# Altium project DelSlowEGT.PrjPcb
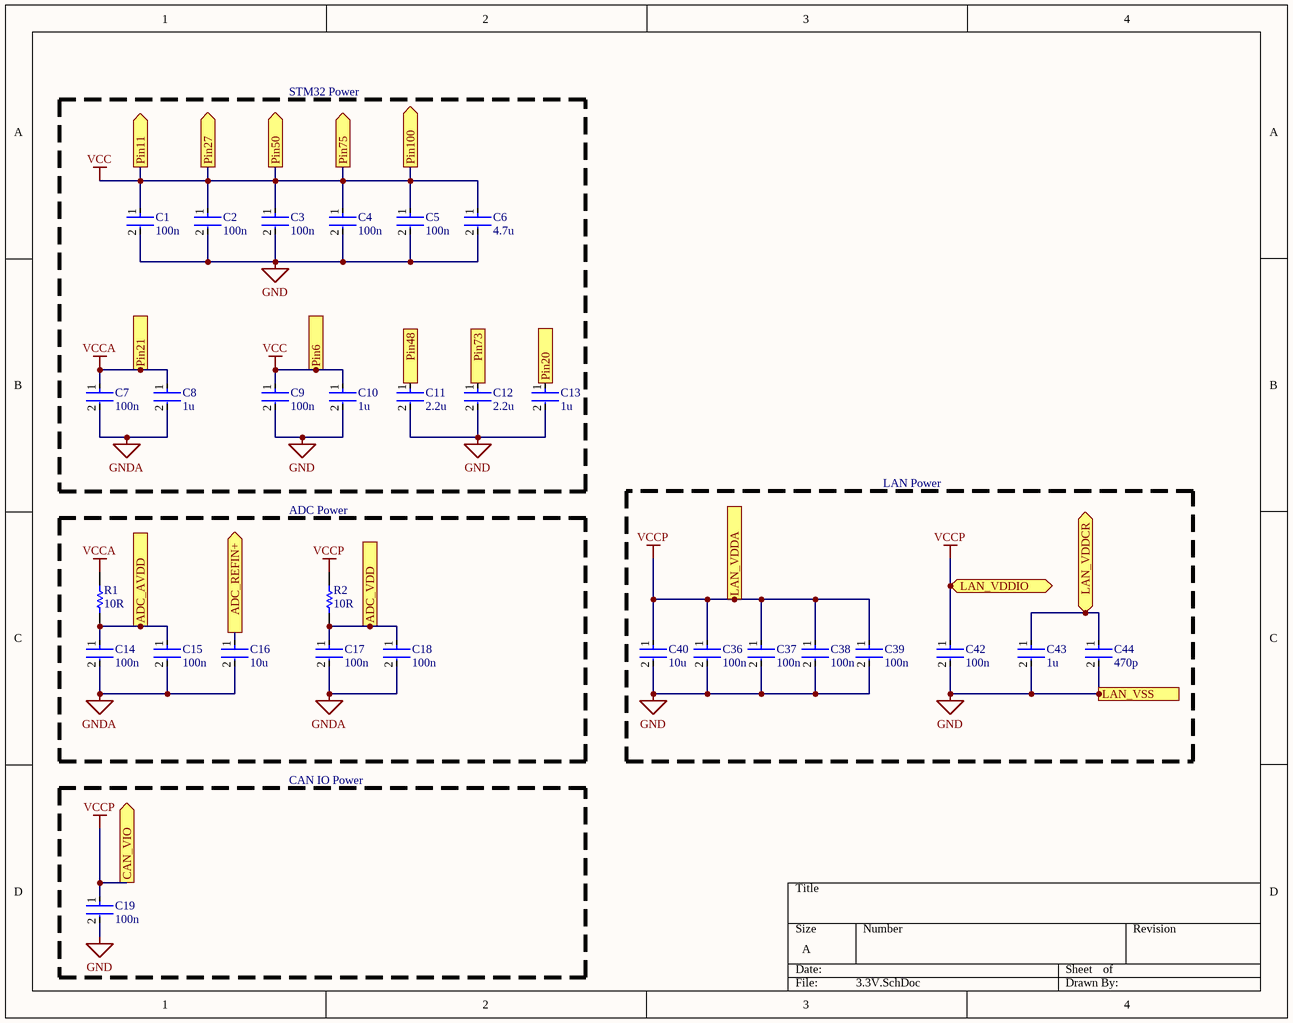
[diagram p0: 3.3V.SchDoc]
7 sheets, 118 parts. Net scope: flat (ports and power ports of the same name join across sheets).
Board file: BoardLayout.PcbDoc
Sheets:
  3.3V.SchDoc
  MCUPinout.SchDoc
  ADC.SchDoc
  BAT.SchDoc
  ETH.SchDoc
  RJ45.SchDoc
  Random.SchDoc

## Sheet 3.3V.SchDoc: 3.3V
size A; DrawnBy: Elijah; SheetNumber: 1; SheetTotal: 7

### Parts
C1  100n  [FP-GRM033-0_03-MFG]
C2  100n  [FP-GRM033-0_03-MFG]
C3  100n  [FP-GRM033-0_03-MFG]
C4  100n  [FP-GRM033-0_03-MFG]
C5  100n  [FP-GRM033-0_03-MFG]
C6  4.7u  [FP-C1005-050-0_15-MFG]
C7  100n  [FP-GRM033-0_03-MFG]
C8  1u  [FP-C2012-125-0_2-IPC_A]
C9  100n  [FP-GRM033-0_03-MFG]
C10  1u  [FP-C2012-125-0_2-IPC_A]
C11  2.2u  [FP-GRM188-0_1-e0_2_0_5-MFG]
C12  2.2u  [FP-GRM188-0_1-e0_2_0_5-MFG]
C13  1u  [FP-C2012-125-0_2-IPC_A]
C14  100n  [FP-GRM033-0_03-MFG]
C15  100n  [FP-GRM033-0_03-MFG]
C16  10u  [FP-C0805C-DG-MFG]
C17  100n  [FP-GRM033-0_03-MFG]
C18  100n  [FP-GRM033-0_03-MFG]
C19  100n  [FP-GRM033-0_03-MFG]
C36  100n  [FP-GRM033-0_03-MFG]
C37  100n  [FP-GRM033-0_03-MFG]
C38  100n  [FP-GRM033-0_03-MFG]
C39  100n  [FP-GRM033-0_03-MFG]
C40  10u  [FP-C0805C-DG-MFG]
C42  100n  [FP-GRM033-0_03-MFG]
C43  1u  [FP-C1005-050-0_15-MFG]
C44  470p  [FP-C1005-050-0_15-MFG]
R1  10R  [RESC2013X60X35ML10T20]
R2  10R  [RESC2013X60X35ML10T20]

### Blocks framed on the sheet
STM32 Power: C1-C13
LAN Power: C36-C40 C42-C44
ADC Power: C14-C18 R1 R2
CAN IO Power: C19

### Ports
ADC_AVDD (out, see ADC[1A]), ADC_REFIN+ (out, see ADC[2B]), ADC_VDD (out, see ADC[2A]), CAN_VIO (out, see ADC[3B]), LAN_VDDA (out, see ETH[2A]), LAN_VDDCR (bidir, see ETH[2B]), LAN_VDDIO (bidir, see ETH[2B]), LAN_VSS (see ETH[3C]), Pin6 (out, see MCUPinout[1A]), Pin11 (out, see MCUPinout[1B]), Pin20 (out, see MCUPinout[3B]), Pin21 (out, see MCUPinout[1B]), Pin27 (out, see MCUPinout[1B]), Pin48 (out, see MCUPinout[3C]), Pin50 (out, see MCUPinout[3A]), Pin73 (out, see MCUPinout[4B]), Pin75 (out, see MCUPinout[3B]), Pin100 (out, see MCUPinout[4A], MCUPinout[5B], MCUPinout[6B])

### Nets
GND: C1.2 C2.2 C3.2 C4.2 C5.2 C6.2 C7.2 C8.2 C9.2 C10.2 C11.2 C12.2 C13.2 C14.2 C15.2 C16.2 C17.2 C18.2 C19.2 C36.2 C37.2 C38.2 C39.2 C40.2 C42.2 C43.2 C44.2 ; port LAN_VSS  [also labelled GNDA]
VCC: C1.1 C2.1 C3.1 C4.1 C5.1 C6.1 C9.1 C10.1 ; port Pin11, port Pin27, port Pin50, port Pin75, port Pin100, port Pin6
VCCA: C7.1 C8.1 R1.1 ; port Pin21
VCCP: C19.1 C36.1 C37.1 C38.1 C39.1 C40.1 C42.1 R2.1 ; port CAN_VIO, port LAN_VDDA, port LAN_VDDIO
NetC11_1: C11.1 ; port Pin48
NetC12_1: C12.1 ; port Pin73
NetC13_1: C13.1 ; port Pin20
NetC14_1: C14.1 C15.1 R1.2 ; port ADC_AVDD
NetC16_1: C16.1 ; port ADC_REFIN+
NetC17_1: C17.1 C18.1 R2.2 ; port ADC_VDD
NetC43_1: C43.1 C44.1 ; port LAN_VDDCR

### Library data of the parts
C1-C5 C7 C9 C14 C15 C17-C19 C36-C39 C42 = CMP-06035-000062-2: Chip Multilayer Ceramic Capacitors for General Purpose, 0201, 0.10uF, X5R, 15%, 10%, 6.3V; Capacitance: 100nF; Min Operating Temperature: -55°C; Lead Free: Lead Free; Radiation Hardening: No; Dielectric: X5R; Voltage Rating (DC): 6.3V; REACH SVHC: No SVHC; Case/Package: 0201; Voltage Rating: 6.3V; Length: 0.6mm; Max Operating Temperature: 85°C; Width: 0.012inch; Depth: 0.3mm; Material: Ceramic; Case Code (Metric): 0603; Thickness: 0.013inch; Packaging: Tape and Reel; Height: 0.3mm; Weight: 6E-06oz; Package Quantity: 1; Mount: Surface Mount; Voltage: 6.3V; Case Code (Imperial): 0201; Tolerance: 10%; Termination: SMD/SMT
C6 C43 C44 = CMP-2000-05997-2: CAP CER 4.7UF 10V X5R 0402; Dielectric Material: Ceramic; Tolerance: 10%; Series: C; Package Quantity: 10000; Max Operating Temperature: 85°C; Case Code (Imperial): 0402; Lead Free: Lead Free; Voltage Rating (DC): 10V; Packaging: Cut Tape; Voltage Rating: 10V; Min Operating Temperature: -55°C; Dielectric: X5R; Thickness: 0.022inch; Width: 0.02inch; Case/Package: 0402; Case Code (Metric): 1005; Capacitance: 4.7uF; Length: 0.039inch; RoHS Compliant: Yes; REACH SVHC: No SVHC; Mount: Surface Mount
C8 C10 C13 = CMP-08246-005389-1: Multilayer Ceramic Capacitors 1μF ±10% 25V X5R SMD 0805; Capacitance: 1uF; Min Operating Temperature: -55°C; Construction: Flat; Package Quantity: 2000; Height: 1.25mm; Resistor Type: Ceramic; Case/Package: 0805; Depth: 1.25mm; Case Code (Metric): 2012; Weight: 0.000194oz; REACH SVHC: No SVHC; Dielectric: X5R; Max Operating Temperature: 85°C; Number of Pins: 2; Thickness: 0.057inch; RoHS Compliant: Yes; Radiation Hardening: No; Lead Free: Lead Free; Case Code (Imperial): 0805; Length: 2mm; Voltage Rating: 25V; Mount: Surface Mount; Voltage Rating (DC): 25V; Packaging: Tape and Reel; Dielectric Material: Ceramic; Termination: SMD/SMT; Voltage: 25V; Tolerance: 10%; Series: C; Width: 0.049inch
C11 C12 = CMP-2006-02836-2: Chip Multilayer Ceramic Capacitors for General Purpose, 0603, 2.2uF, X7R, 15%, 10%, 10V; Case Code (Metric): 1608; Height: 0.8mm; Packaging: Cut Tape; Voltage: 10V; Lead Free: Lead Free; Min Operating Temperature: -55°C; Voltage Rating (DC): 10V; Max Operating Temperature: 125°C; Voltage Rating: 10V; Dielectric: X7R; Depth: 0.8mm; Case Code (Imperial): 0603; Termination: SMD/SMT; Case/Package: 0603; Number of Pins: 2; REACH SVHC: No SVHC; Mount: Surface Mount; Width: 0.031inch; Material: Ceramic; Capacitance: 2.2uF; Package Quantity: 1; Weight: 7.1E-05oz; Length: 1.6mm; Thickness: 0.035inch; Tolerance: 10%
C16 C40 = CMP-2007-03243-2: CAP CER 10UF 10V X5R 0805; Manufacturer Part Number: C0805C106K8PACTU; Manufacturer: Kemet; 3DS Part Number: 220-00001; Tolerance: 10%; Temperature Coefficient: 15%; Material: Ceramic; Device Class L2: Capacitors; Device Class L1: Passive Components; ComponentLink2URL: https://content.kemet.com/datasheets/KEM_C1006_X5R_SMD.pdf; Height: 1.4mm; Lead Free: Yes; Digikey Description: CAP CER 10UF 10V X5R 0805; Octopart: https://octopart.com/c0805c106k8pactu-kemet-98697; Capacitance: 10uF; Value: 10uF; Temperature Range Low: -55°C; Temperature: -55°C to +85°C; Automotive: No; Mouser Description: CAP CER 10UF 10V X5R 0805; Ipc Land Pattern Name: CAPC200125X125; Temperature Range High: +85°C; Voltage: 10V; RoHS: TRUE; Device Class L3: Ceramic Capacitors; ComponentLink2Description: Datasheet; Voltage Rating: 10V; Package: C0805C-DG; Temperature Characteristic: X5R; Category: Cap
R1 R2 = CMP-2100-03670-1: Chip Resistor, 10 Ohm, +/- 1%, 0.125 W, -55 to 155 degC, 0805 (2012 Metric), RoHS, Tape and Reel; Manufacturer: Yageo; Resistance: 10Ohm; Power Rating: 125mW; Voltage Rating: 150V; Temperature Coefficient: 200ppm/degreesC; Number of Pins: 2; REACH SVHC: NoSVHC; Datasheet Version: Rev. 5, 10/2016; Max Operating Temperature: 155degC; Manufacturer URL: http://www.yageo.com/; Case Code (Imperial): 0805; Package Description: 2-Pin Surface Mounted Device, Body 2 x 1.25 mm; Case Code (Metric): 2012; Length: 2mm; RoHSCompliant: true; Max Power Dissipation: 125mW; Depth: 1.25mm; Packaging: TapeandReel; Height: 0.5mm; Package Reference: 0805; Package Quantity: 1; Tolerance: 1%; Termination: SMD/SMT; Min Operating Temperature: -55degC; Lead Free: LeadFree; Width: 1.25mm; Voltage Rating (DC): 150V; Datasheet URL: http://www.yageo.com/NewPortal/yageodocoutput?fileName=/pdf/R-Chip/PYu-RC_Group_51_RoHS_L_5.pdf; Composition: ThickFilm; Number of Terminations: 2; Case/Package: 0805

## Sheet MCUPinout.SchDoc
size B; SheetNumber: 2; SheetTotal: 7
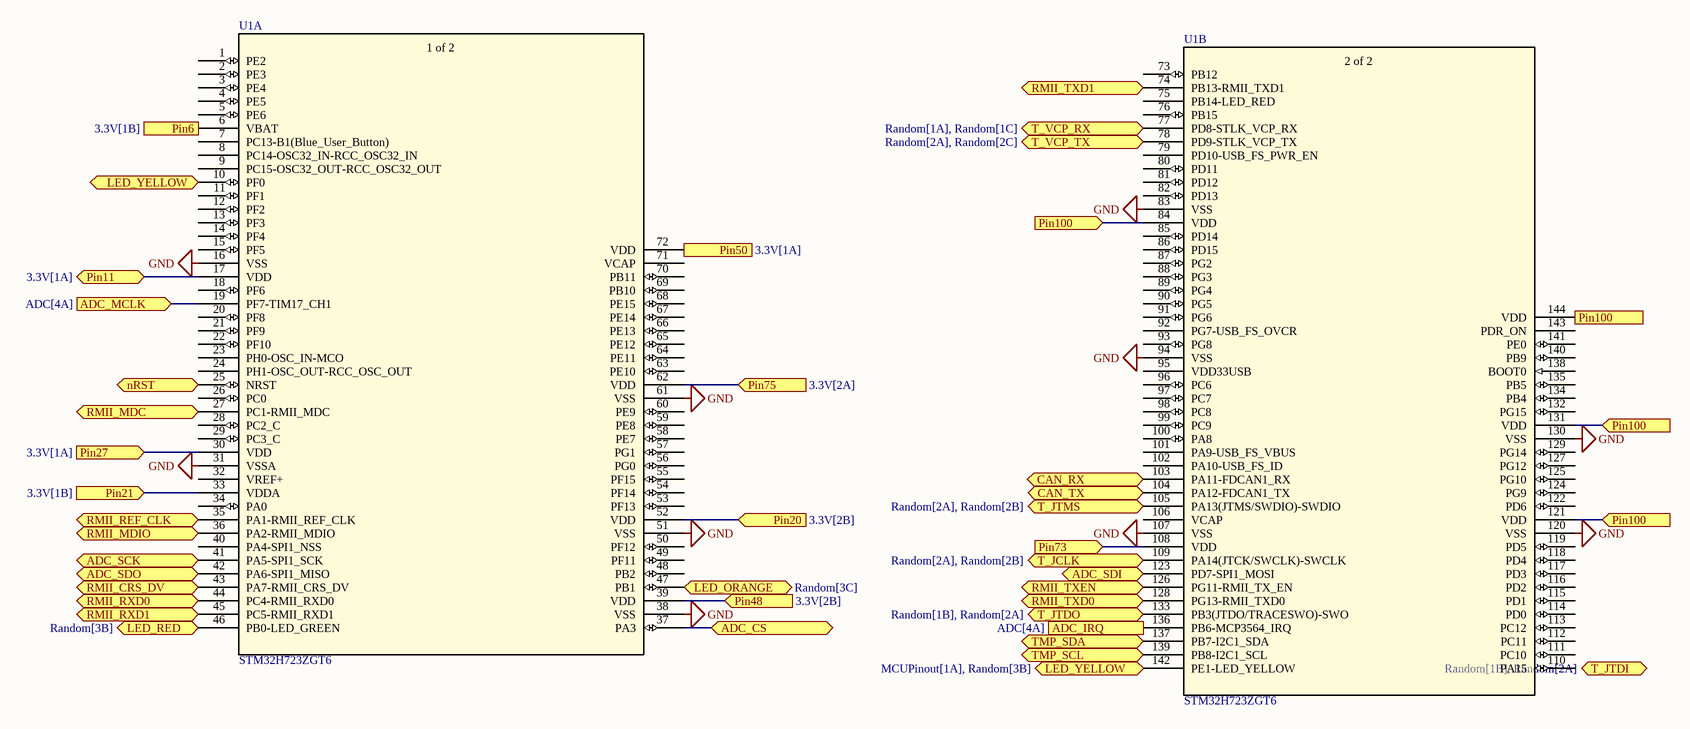
[diagram p1: MCUPinout.SchDoc]

### Parts
U1  STM32H723ZGT6  [LQFP144_STM]  (parts A,B of 2)

### Ports
ADC_CS (bidir, see ADC[4A]), ADC_IRQ (out, see ADC[4A]), ADC_MCLK (in, see ADC[4A]), ADC_SCK (bidir, see ADC[4A]), ADC_SDI (bidir, see ADC[4A]), ADC_SDO (bidir, see ADC[4A]), CAN_RX (bidir, see ADC[3C]), CAN_TX (bidir, see ADC[3C]), LED_ORANGE (bidir, see Random[3C]), LED_RED (bidir, see Random[3B]), LED_YELLOW (bidir, see MCUPinout[1A], Random[3B]), LED_YELLOW (bidir, see MCUPinout[4C], Random[3B]), nRST (bidir, see ETH[1C], Random[2A], Random[2C]), Pin6 (in, see 3.3V[1B]), Pin11 (bidir, see 3.3V[1A]), Pin20 (in, see 3.3V[2B]), Pin21 (in, see 3.3V[1B]), Pin27 (in, see 3.3V[1A]), Pin48 (in, see 3.3V[2B]), Pin50 (in, see 3.3V[1A]), Pin73 (in, see 3.3V[2B]), Pin75 (in, see 3.3V[2A]), Pin100 (in, see 3.3V[2A], MCUPinout[4A], MCUPinout[5B], MCUPinout[6B]), Pin100 (in, see 3.3V[2A], MCUPinout[4A], MCUPinout[6B]), Pin100 (in, see 3.3V[2A], MCUPinout[5B], MCUPinout[6B]), RMII_CRS_DV (bidir, see ETH[1C]), RMII_MDC (bidir, see ETH[1C]), RMII_MDIO (bidir, see ETH[1C]), RMII_REF_CLK (bidir, see ETH[3B]), RMII_RXD0 (bidir, see ETH[1B]), RMII_RXD1 (bidir, see ETH[1B]), RMII_TXD0 (bidir, see ETH[1B]), RMII_TXD1 (bidir, see ETH[1B]), RMII_TXEN (bidir, see ETH[1B]), T_JCLK (bidir, see Random[2A], Random[2B]), T_JTDI (bidir, see Random[1B], Random[2A]), T_JTDO (bidir, see Random[1B], Random[2A]), T_JTMS (bidir, see Random[2A], Random[2B]), T_VCP_RX (bidir, see Random[1A], Random[1C]), T_VCP_TX (bidir, see Random[2A], Random[2C]), TMP_SCL (bidir, see ADC[1D]), TMP_SDA (bidir, see ADC[1D])

### Nets
GND: U1.16(VSS) U1.31(VSSA) U1.38(VSS) U1.51(VSS) U1.61(VSS) U1.83(VSS) U1.94(VSS) U1.107(VSS) U1.120(VSS) U1.130(VSS)
VCC: U1.6(VBAT) U1.17(VDD) U1.30(VDD) U1.62(VDD) U1.72(VDD) U1.84(VDD) U1.121(VDD) U1.131(VDD) U1.144(VDD) ; port Pin11, port Pin27, port Pin50, port Pin75, port Pin100, port Pin6
VCCA: U1.33(VDDA) ; port Pin21
NetC11_1: U1.39(VDD) ; port Pin48
NetC12_1: U1.108(VDD) ; port Pin73
NetC13_1: U1.52(VDD) ; port Pin20
NetD3_1: U1.133(PB3(JTDO/TRACESWO)-SWO) ; port T_JTDO
NetD3_4: U1.109(PA14(JTCK/SWCLK)-SWCLK) ; port T_JCLK
NetD3_6: U1.105(PA13(JTMS/SWDIO)-SWDIO) ; port T_JTMS
NetD4_1: U1.77(PD8-STLK_VCP_RX) ; port T_VCP_RX
NetD4_4: U1.78(PD9-STLK_VCP_TX) ; port T_VCP_TX
NetD4_6: U1.25(NRST) ; port nRST
NetD5_2: U1.46(PB0-LED_GREEN) ; port LED_RED
NetD6_2: U1.10(PF0) U1.142(PE1-LED_YELLOW) ; port LED_YELLOW
NetD7_2: U1.47(PB1) ; port LED_ORANGE
NetR3_2: U1.19(PF7-TIM17_CH1) ; port ADC_MCLK
NetR4_2: U1.136(PB6-MCP3564_IRQ) ; port ADC_IRQ
NetR5_2: U1.41(PA5-SPI1_SCK) ; port ADC_SCK
NetR6_2: U1.123(PD7-SPI1_MOSI) ; port ADC_SDI
NetR7_2: U1.42(PA6-SPI1_MISO) ; port ADC_SDO
NetR8_2: U1.37(PA3) ; port ADC_CS
NetR10_2: U1.139(PB8-I2C1_SCL) ; port TMP_SCL
NetR11_2: U1.137(PB7-I2C1_SDA) ; port TMP_SDA
NetR16_1: U1.36(PA2-RMII_MDIO) ; port RMII_MDIO
NetR18_1: U1.45(PC5-RMII_RXD1) ; port RMII_RXD1
NetR19_1: U1.43(PA7-RMII_CRS_DV) ; port RMII_CRS_DV
NetU1_27: U1.27(PC1-RMII_MDC) ; port RMII_MDC
NetU1_35: U1.35(PA1-RMII_REF_CLK) ; port RMII_REF_CLK
NetU1_44: U1.44(PC4-RMII_RXD0) ; port RMII_RXD0
NetU1_74: U1.74(PB13-RMII_TXD1) ; port RMII_TXD1
NetU1_103: U1.103(PA11-FDCAN1_RX) ; port CAN_RX
NetU1_104: U1.104(PA12-FDCAN1_TX) ; port CAN_TX
NetU1_126: U1.126(PG11-RMII_TX_EN) ; port RMII_TXEN
NetU1_128: U1.128(PG13-RMII_TXD0) ; port RMII_TXD0

Not connected (* = marked no-connect by the designer): U1 1(PE2) 2(PE3) 3(PE4) 4(PE5) 5(PE6) 7(PC13-B1(Blue_User_Button)) 8(PC14-OSC32_IN-RCC_OSC32_IN) 9(PC15-OSC32_OUT-RCC_OSC32_OUT) 11(PF1) 12(PF2) 13(PF3) 14(PF4) 15(PF5) 18(PF6) 20(PF8) 21(PF9) 22(PF10) 23(PH0-OSC_IN-MCO) 24(PH1-OSC_OUT-RCC_OSC_OUT) 26(PC0) 28(PC2_C) 29(PC3_C) 32(VREF+) 34(PA0) 40(PA4-SPI1_NSS) 48(PB2) 49(PF11) 50(PF12) 53(PF13) 54(PF14) 55(PF15) 56(PG0) 57(PG1) 58(PE7) 59(PE8) 60(PE9) 63(PE10) 64(PE11) 65(PE12) 66(PE13) 67(PE14) 68(PE15) 69(PB10) 70(PB11) 71(VCAP) 73(PB12) 75(PB14-LED_RED) 76(PB15) 79(PD10-USB_FS_PWR_EN) 80(PD11) 81(PD12) 82(PD13) 85(PD14) 86(PD15) 87(PG2) 88(PG3) 89(PG4) 90(PG5) 91(PG6) 92(PG7-USB_FS_OVCR) 93(PG8) 95(VDD33USB) 96(PC6) 97(PC7) 98(PC8) 99(PC9) 100(PA8) 101(PA9-USB_FS_VBUS) 102(PA10-USB_FS_ID) 106(VCAP) 110(PA15) 111(PC10) 112(PC11) 113(PC12) 114(PD0) 115(PD1) 116(PD2) 117(PD3) 118(PD4) 119(PD5) 122(PD6) 124(PG9) 125(PG10) 127(PG12) 129(PG14) 132(PG15) 134(PB4) 135(PB5) 138(BOOT0) 140(PB9) 141(PE0) 143(PDR_ON)

### Notes on the sheet
- (in symbol STM32H723ZGT6, part A) 1 of 2
- (in symbol STM32H723ZGT6, part B) 2 of 2

### Library data of the parts
U1 = STM32H723ZGT6: No Description Available; Mfr_Name: STMicroelectronics; RefDes: RefDes; Type: Type

## Sheet ADC.SchDoc
size A; SheetNumber: 3; SheetTotal: 7
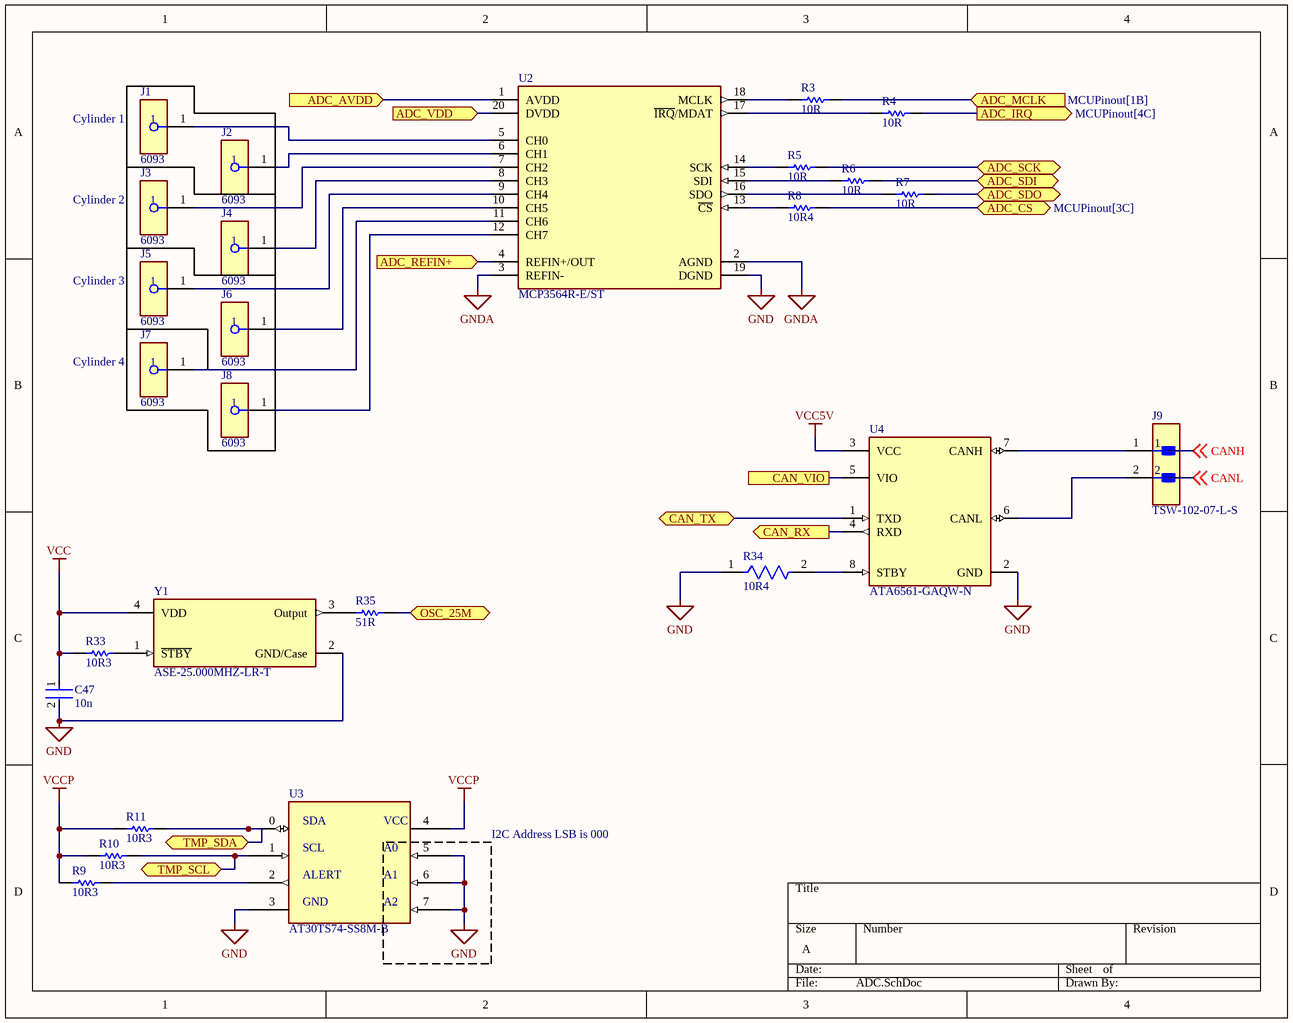
[diagram p2: ADC.SchDoc]

### Parts
C47  10n  [FP-GRM033-0_03-MFG]
J1  6093  [FP-6093-MFG]
J2  6093  [FP-6093-MFG]
J3  6093  [FP-6093-MFG]
J4  6093  [FP-6093-MFG]
J5  6093  [FP-6093-MFG]
J6  6093  [FP-6093-MFG]
J7  6093  [FP-6093-MFG]
J8  6093  [FP-6093-MFG]
J9  TSW-102-07-L-S  [FP-TSW-102-07-L-S-MFG]
R3  10R  [RESC2013X60X35ML10T20]
R4  10R  [RESC2013X60X35ML10T20]
R5  10R  [RESC2013X60X35ML10T20]
R6  10R  [RESC2013X60X35ML10T20]
R7  10R  [RESC2013X60X35ML10T20]
R8  10R4  [RESC2013X60X35ML10T20]
R9  10R3  [RESC3116X65X40ML10T20]
R10  10R3  [RESC3116X65X40ML10T20]
R11  10R3  [RESC3116X65X40ML10T20]
R33  10R3  [RESC3116X65X40ML10T20]
R34  10R4  [FP-RC0603-0_55-IPC_C]
R35  51R  [RESC3116X65X40ML10T20]
U2  MCP3564R-E/ST  [FP-C04-088-MFG]
U3  AT30TS74-SS8M-B  [MCHP-SN8_V]
U4  ATA6561-GAQW-N  [FP-C04-057-OA-MFG]
Y1  ASE-25.000MHZ-LR-T  [FP-ASE-MFG]

### Ports
ADC_AVDD (in, see 3.3V[1C]), ADC_CS (bidir, see MCUPinout[3C]), ADC_IRQ (out, see MCUPinout[4C]), ADC_MCLK (in, see MCUPinout[1B]), ADC_REFIN+ (in, see 3.3V[1C]), ADC_SCK (bidir, see MCUPinout[1B]), ADC_SDI (bidir, see MCUPinout[4B]), ADC_SDO (bidir, see MCUPinout[1B]), ADC_VDD (in, see 3.3V[2C]), CAN_RX (out, see MCUPinout[4B]), CAN_TX (bidir, see MCUPinout[4B]), CAN_VIO (see 3.3V[1D]), OSC_25M (bidir, see ETH[3B]), TMP_SCL (bidir, see MCUPinout[4C]), TMP_SDA (bidir, see MCUPinout[4C])

### Nets
GND: C47.2 R34.1 U2.2(AGND) U2.3(REFIN-) U2.19(DGND) U3.3 U3.5 U3.6 U3.7 U4.2(GND) Y1.2(GND/Case)  [also labelled GNDA]
VCC: C47.1 R33.1 Y1.4(VDD)
VCC5V: U4.3(VCC)
VCCP: R9.1 R10.1 R11.1 U3.4 U4.5(VIO) ; port CAN_VIO
NetC14_1: U2.1(AVDD) ; port ADC_AVDD
NetC16_1: U2.4(REFIN+/OUT) ; port ADC_REFIN+
NetC17_1: U2.20(DVDD) ; port ADC_VDD
NetJ1_1: J1.1 U2.5(CH0)
NetJ2_1: J2.1 U2.6(CH1)
NetJ3_1: J3.1 U2.7(CH2)
NetJ4_1: J4.1 U2.8(CH3)
NetJ5_1: J5.1 U2.9(CH4)
NetJ6_1: J6.1 U2.10(CH5)
NetJ7_1: J7.1 U2.11(CH6)
NetJ8_1: J8.1 U2.12(CH7)
NetJ9_1: J9.1 U4.7(CANH)
NetJ9_2: J9.2 U4.6(CANL)
NetR3_1: R3.1 U2.18(MCLK)
NetR3_2: R3.2 ; port ADC_MCLK
NetR4_1: R4.1 U2.17(~{IRQ}/MDAT)
NetR4_2: R4.2 ; port ADC_IRQ
NetR5_1: R5.1 U2.14(SCK)
NetR5_2: R5.2 ; port ADC_SCK
NetR6_1: R6.1 U2.15(SDI)
NetR6_2: R6.2 ; port ADC_SDI
NetR7_1: R7.1 U2.16(SDO)
NetR7_2: R7.2 ; port ADC_SDO
NetR8_1: R8.1 U2.13(~{CS})
NetR8_2: R8.2 ; port ADC_CS
NetR9_2: R9.2 U3.2
NetR10_2: R10.2 U3.1 ; port TMP_SCL
NetR11_2: R11.2 U3.0 ; port TMP_SDA
NetR23_2: R35.2 ; port OSC_25M
NetR33_2: R33.2 Y1.1(~{STBY})
NetR34_2: R34.2 U4.8(STBY)
NetR35_1: R35.1 Y1.3(Output)
NetU1_103: U4.4(RXD) ; port CAN_RX
NetU1_104: U4.1(TXD) ; port CAN_TX

### Notes on the sheet
- (near J1) Cylinder 1
- (near J3) Cylinder 2
- (near J5) Cylinder 3
- (near J7) Cylinder 4
- I2C Address LSB is 000
- (in symbol AT30TS74_0217) SDA; VCC; SCL; A0; ALERT; A1; GND; A2

### Library data of the parts
C47 = CMP-06035-000062-2: as C1 on sheet 3.3V; Min Operating Temperature: -55°C; Lead Free: Lead Free; Radiation Hardening: No; Dielectric: X5R; Voltage Rating (DC): 6.3V; REACH SVHC: No SVHC; Case/Package: 0201; Voltage Rating: 6.3V; Length: 0.6mm; Max Operating Temperature: 85°C; Width: 0.012inch; Depth: 0.3mm; Material: Ceramic; Case Code (Metric): 0603; Thickness: 0.013inch; Packaging: Tape and Reel; Height: 0.3mm; Weight: 6E-06oz; Package Quantity: 1; Mount: Surface Mount; Voltage: 6.3V; Case Code (Imperial): 0201; Tolerance: 10%; Termination: SMD/SMT
J1-J8 = CMP-19636-000026-1: CONN BANANA JACK SOLDER LUG RED; Gender: Female; Pitch: 0.375inch; Number of Contacts: 3; Insulation: Mating End Insulated; Body Material: Brass; Hole Diameter: 0.12inch; Material: Paper; Contact Material: Brass; Number of Rows: 1; Contact Plating: Tin; Series: -; RoHS Compliant: No; Insulation Material: Nylon; Orientation: Straight; Package Quantity: 1; REACH SVHC: No SVHC; Termination: Solder; Number of Positions: 3; Color: Red; Mount: Panel; Lead Free: Lead Free; Packaging: Bulk
J9 = CMP-02766-001428-1: CONN HEADER VERT 2POS 2.54MM; Voltage Rating: 550V; Current Rating: 7.6A; Gender: Male; Number of Contacts: 2; Connector Type: Male Pin; Radiation Hardening: No; Orientation: Straight; Contact Plating: Gold; Max Operating Temperature: 125°C; Mount: Through Hole; Package Quantity: 1; Number of Rows: 1; Housing Material: Polyester; RoHS Compliant: Yes; Length: 5.08mm; Max Voltage Rating (AC): 550V; Pitch: 2.54mm; Packaging: Bulk; Depth: 2.54mm; Termination: Solder; Min Operating Temperature: -55°C; Housing Color: Black; Lead Free: Lead Free; Color: Black; Number of Positions: 2; Width: 2.54mm; Max Current Rating: 7.6A; REACH SVHC: No SVHC; Contact Material: Bronze; Contact Mating Length: 0.23inch; Series: TSW; Contact Type: Male Pin
R3-R8 = CMP-2100-03670-1: as R1 on sheet 3.3V; Number of Pins: 2; REACH SVHC: NoSVHC; Datasheet Version: Rev. 5, 10/2016; Max Operating Temperature: 155degC; Manufacturer URL: http://www.yageo.com/; Case Code (Imperial): 0805; Package Description: 2-Pin Surface Mounted Device, Body 2 x 1.25 mm; Case Code (Metric): 2012; Length: 2mm; RoHSCompliant: true; Max Power Dissipation: 125mW; Depth: 1.25mm; Packaging: TapeandReel; Height: 0.5mm; Package Reference: 0805; Package Quantity: 1; Tolerance: 1%; Termination: SMD/SMT; Min Operating Temperature: -55degC; Lead Free: LeadFree; Width: 1.25mm; Voltage Rating (DC): 150V; Datasheet URL: http://www.yageo.com/NewPortal/yageodocoutput?fileName=/pdf/R-Chip/PYu-RC_Group_51_RoHS_L_5.pdf; Composition: ThickFilm; Number of Terminations: 2; Case/Package: 0805
R9-R11 R33 R35 = CMP-2100-03678-1: Chip Resistor, 1 KOhm, +/- 1%, 0.25 W, -55 to 155 degC, 1206 (3216 Metric), RoHS, Tape and Reel; Manufacturer: Yageo; Temperature Coefficient: 100ppm/degreesC; Power Rating: 250mW; Voltage Rating: 200V; Resistance: 1KOhm; Composition: ThickFilm; Min Operating Temperature: -55degC; Tolerance: 1%; REACH SVHC: Unknown; Case Code (Metric): 3216; Military Standard: Not; Datasheet Version: Rev. 5, 10/2016; Package Reference: 1206.0; Case/Package: 1206; Length: 3.1mm; Manufacturer URL: http://www.yageo.com/; Lead Free: LeadFree; RoHSCompliant: true; Termination: SMD/SMT; Packaging: TapeandReel; Package Description: 2-Pin Surface Mount Device, Body 3.1 x 1.6 mm; Depth: 1.6mm; Case Code (Imperial): 1206; Max Operating Temperature: 155degC; Datasheet URL: http://www.yageo.com/NewPortal/yageodocoutput?fileName=/pdf/R-Chip/PYu-RC_Group_51_RoHS_L_5.pdf; Height: 0.55mm
R34 = CMP-2100-03664-2: RES 10K OHM 1% 1/10W 0603; Voltage Rating: 75V; Voltage Rating (DC): 50V; Resistance: 10kR; Power Rating: 100mW; Temperature Coefficient: 100ppm/°C; Depth: 0.8mm; Termination: SMD/SMT; Resistor Type: Thick Film; Series: RC; Construction: Rectangular; Features: Moisture Resistant; Packaging: Tape and Reel; Min Operating Temperature: -55°C; Number of Terminations: 2; Lead Pitch: 0.3mm; RoHS Compliant: Yes; Case/Package: 0603; Resistance Tolerance: 1%; Military Standard: Not; Weight: 7.1E-05oz; Number of Pins: 2; Tolerance: 1%; Length: 1.6mm; Case Code (Imperial): 0603; Lead Free: Lead Free; Width: 0.8mm; Max Power Dissipation: 100mW; Height: 0.45mm; Max Operating Temperature: 155°C; Case Code (Metric): 1608; Size Code: 0603
U2 = CMP-00252-111742343-1: MCP3564R-E/ST 8-Channel Single ADC Delta-Sigma 153.6ksps 24-bit Serial 20-Pin TSSOP Tube; Interface: SPI; Max Junction Temperature (Tj): 150°C; Min Supply Voltage: 1.8V; Number of Channels: 8; Max Supply Voltage: 3.6V; Number of Converters: 1; Max Operating Temperature: 125°C; Lifecycle Status: Production; Height: 1.2mm; Ambient Temperature Range High: 125°C; NexarPartId: 111742343; Sampling Rate: 153.6ksps; Min Operating Temperature: -40°C
U3 = AT30TS74_0217: Temp Sensor Digital Serial (2-Wire, I2C, SMBus) 8-Pin SOIC Tube; pin to pad: 0>1 1>2 2>3 3>4 4>5 5>6 6>7 7>8; Manufacturer: Microchip; Package Shape/Style: Rectangular; Accuracy-Max (Cel): 3°C; Number of Bits: 12; Operating Current-Max: 800uA; Sensor Type: TEMPERATURE SENSOR,SWITCH/DIGITAL OUTPUT,SERIAL; Max Supply Voltage: 5.5V; Min Supply Voltage: 1.7V; Body Breadth: 3.9inch; Body Height: 1.75mm; Body Length or Diameter: 4.9mm; Supplier: Mouser; Supplier Part Number: 556-AT30TS74-SS8M-B; Manufacturer Part Number: AT30TS74-SS8M-B; Category: Uncategorized; Stock: 7962; Pricing: 1=0.82, 10=0.82, 50=0.68, 100=0.662, 1000=0.662, 10000=0.654 (USD); Mounting Technology: Surface Mount; Housing Material: Plastic; Min Operating Temperature: -40°C; Max Operating Temperature: 125°C; Output Interface Type: 2-Wire; Termination: Solder; Reach SVHC Compliant: Yes; ComponentLink1URL: https://datasheet.ciiva.com:443/pdfs/VipMasterIC/IC/ATML/ATML-S-A0001248569/ATML-S-A0001248569-1.pdf?src-supplier=IHS+Markit; ComponentLink1Description: https://datasheet.ciiva.com:443/pdfs/VipMasterIC/IC/ATML/ATML-S-A0001248569/ATML-S-A0001248569-1.pdf?src-supplier=IHS+Markit; ComponentLink2URL: http://www.microchip.com/mymicrochip/filehandler.aspx?ddocname=en590216&src-supplier=Digikey; ComponentLink2Description: http://www.microchip.com/mymicrochip/filehandler.aspx?ddocname=en590216&src-supplier=Digikey; ComponentLink3URL: http://www.atmel.com/Images/Atmel-8897-DTS-AT30TS74-Datasheet.pdf?src-supplier=Avnet; ComponentLink3Description: http://www.atmel.com/Images/Atmel-8897-DTS-AT30TS74-Datasheet.pdf?src-supplier=Avnet; ComponentLink4URL: https://datasheet.octopart.com/AT30TS74-SS8M-B-Microchip-datasheet-140384934.pdf?src-supplier=microchipDIRECT; ComponentLink4Description: https://datasheet.octopart.com/AT30TS74-SS8M-B-Microchip-datasheet-140384934.pdf?src-supplier=microchipDIRECT
U4 = CMP-06279-000002-1: IC TRANSCEIVER 1/1 8SO; Manufacturer: Microchip Technology; Min Supply Voltage: 2.8V; Standoff Height: 0.1mm; Nominal Supply Current: 50mA; Interface: CAN; Max Junction Temp: +150°C; Max Supply Voltage: 5.5V; Digikey Description: IC TRANSCEIVER 1/1 8SO; Footprint Url: http://ww1.microchip.com/downloads/en/DeviceDoc/08L_SOIC_150_3dot9mm_OA_C04-00057e.pdf; ComponentLink2Description: Datasheet; Category: IC; Lead Free: Yes; Package: C04-057-OA; Manufacturer Part Number: ATA6561-GAQW-N; Height: 1.75mm; ComponentLink2URL: http://ww1.microchip.com/downloads/en/DeviceDoc/ATA6560-ATA6561-High-Speed-CAN-Transceiver-DS20005991A.pdf; Mouser Description: CAN - Controller Area Network 5Mbps Unpowered/Standby/Normal 4.5V to 5.5V 8-Pin SOIC T/R; Device Class L1: Integrated Circuits (ICs); Device Class L3: unset; Automotive: No; Temperature Range High: +150°C; Temperature: -40°C to +150°C; RoHS: TRUE; Device Class L2: Interface ICs; Temperature Range Low: -40°C; Octopart: https://octopart.com/ata6561-gaqw-n-microchip-93294113; Ipc Land Pattern Name: SOIC127P600X155-8
Y1 = CMP-27762-000357-1: XTAL Oscillator 25MHz ±25ppm CMOS 3.3V 4-SMD 3.2mm x 2.5mm; Min Supply Voltage: 3.135V; Max Supply Current: 13mA; Max Supply Voltage: 3.465V; Load Capacitance: 15pF; Height: 0.047inch; Series: ASE; Frequency Stability: 25ppm; Mount: Surface Mount; Case/Package: SMD/SMT; Width: 0.098inch; Operating Frequency: 25 MHz; REACH SVHC: No SVHC; Package Quantity: 1000; Number of Pins: 4; Termination: SMD/SMT; Frequency: 25MHz; Max Operating Temperature: 85°C; Packaging: Tape and Reel; Min Operating Temperature: -40°C; Lead Free: Lead Free; Length: 0.126inch; Operating Supply Voltage: 3.3V

## Sheet BAT.SchDoc
size A; SheetNumber: 4; SheetTotal: 6
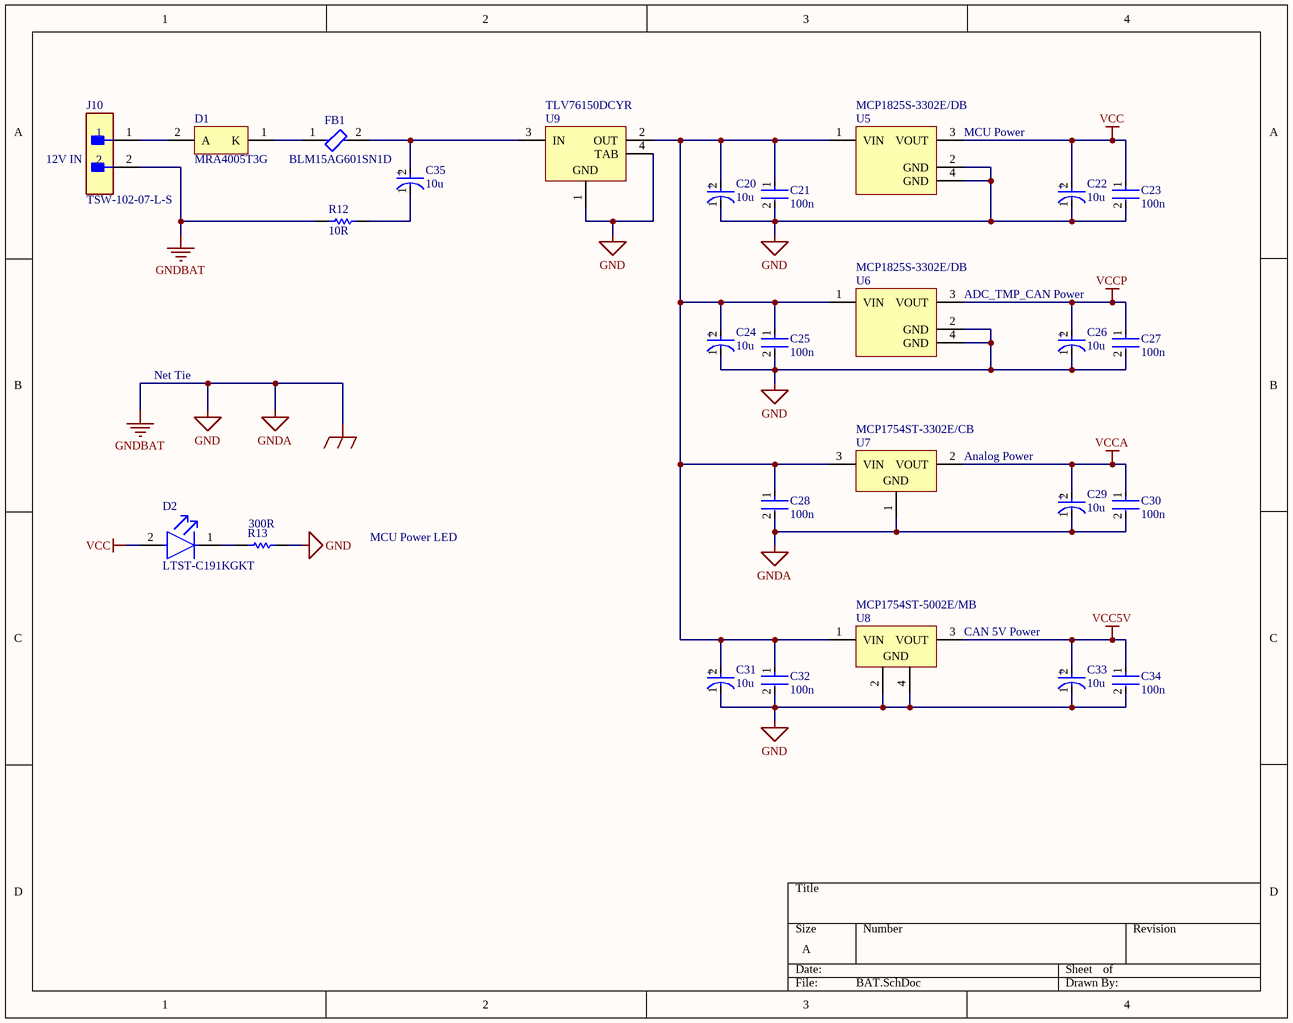
[diagram p3: BAT.SchDoc]

### Parts
C20  10u  [FP-TAJA-MFG]
C21  100n  [FP-GRM033-0_03-MFG]
C22  10u  [FP-TAJA-MFG]
C23  100n  [FP-GRM033-0_03-MFG]
C24  10u  [FP-TAJA-MFG]
C25  100n  [FP-GRM033-0_03-MFG]
C26  10u  [FP-TAJA-MFG]
C27  100n  [FP-GRM033-0_03-MFG]
C28  100n  [FP-GRM033-0_03-MFG]
C29  10u  [FP-TAJA-MFG]
C30  100n  [FP-GRM033-0_03-MFG]
C31  10u  [FP-TAJA-MFG]
C32  100n  [FP-GRM033-0_03-MFG]
C33  10u  [FP-TAJA-MFG]
C34  100n  [FP-GRM033-0_03-MFG]
C35  10u  [FP-TAJA-MFG]
D1  MRA4005T3G  [ONSC-SMA-2-403D-02_V]
D2  LTST-C191KGKT  [FP-LTST-C191KSKT-MFG]
FB1  BLM15AG601SN1D  [FP-BLM15-0_05-MFG]
J10  TSW-102-07-L-S  [FP-TSW-102-07-L-S-MFG]
R12  10R  [RESC2013X60X35ML10T20]
R13  300R  [RESC1608X55X30LL20T20]
U5  MCP1825S-3302E/DB  [SOT-223-DB3_N]
U6  MCP1825S-3302E/DB  [SOT-223-DB3_N]
U7  MCP1754ST-3302E/CB  [MCHP-SOT-23A-CB3_N]
U8  MCP1754ST-5002E/MB  [MCHP-SOT-89-MB3_L]
U9  TLV76150DCYR  [DCY0004A_L]

### Nets
GND: C20.1(C) C21.2 C22.1(C) C23.2 C24.1(C) C25.2 C26.1(C) C27.2 C28.2 C29.1(C) C30.2 C31.1(C) C32.2 C33.1(C) C34.2 J10.2 R12.1 R13.2 U5.2(GND) U5.4(GND) U6.2(GND) U6.4(GND) U7.1(GND) U8.2(GND) U8.4(GND) U9.1(GND) U9.4(TAB)  [also labelled GNDA, GNDBAT]
VCC: C22.2(A) C23.1 D2.2(A) U5.3(VOUT)
VCC5V: C33.2(A) C34.1 U8.3(VOUT)
VCCA: C29.2(A) C30.1 U7.2(VOUT)
VCCP: C26.2(A) C27.1 U6.3(VOUT)
NetC20_2: C20.2(A) C21.1 C24.2(A) C25.1 C28.1 C31.2(A) C32.1 U5.1(VIN) U6.1(VIN) U7.3(VIN) U8.1(VIN) U9.2(OUT)
NetC35_1: C35.1(C) R12.2
NetC35_2: C35.2(A) FB1.2 U9.3(IN)
NetD1_1: D1.1(K) FB1.1
NetD1_2: D1.2(A) J10.1
NetD2_1: D2.1(C) R13.1

### Notes on the sheet
- (near J10) 12V IN
- (near U5) MCU Power
- ADC_TMP_CAN Power
- Net Tie
- (near U7) Analog Power
- MCU Power LED
- (near U8) CAN 5V Power
- (in symbol CMP-04424-000097-1) +

### Library data of the parts
C20 C22 C24 C26 C29 C31 C33 C35 = CMP-04424-000097-1: 10uF 6.3V  ±10% 4Ω 1206  SMD Tantalum Capacitor; Leakage Current: 600nA; Q Factor: 6; Polarity: Polar; ESR (Equivalent Series Resistance): 4R; Dissipation Factor: 6%; Tolerance: 20%; Lead Free: Lead Free; Min Operating Temperature: -55°C; Case/Package: 1206; Voltage Rating (DC): 6.3V; Capacitance: 10uF; Mount: Surface Mount; Termination: SMD/SMT; Depth: 1.6mm; Height: 1.6mm; Voltage: 6.3V; Features: General Purpose; Series: TAJ; Voltage Rating: 6.3V; Package Quantity: 1; Max Operating Temperature: 125°C; Width: 1.6mm; Length: 3.2mm; Construction: Flat; REACH SVHC: No SVHC; Case Code (Imperial): 1206; Radiation Hardening: No; RoHS Compliant: Yes; Dielectric Material: Tantalum; Height - Seated (Max): 0.071inch; Case Code (Metric): 3216; Packaging: Tape and Reel
C21 C23 C25 C27 C28 C30 C32 C34 = CMP-06035-000062-2: as C1 on sheet 3.3V; Min Operating Temperature: -55°C; Lead Free: Lead Free; Radiation Hardening: No; Dielectric: X5R; Voltage Rating (DC): 6.3V; REACH SVHC: No SVHC; Case/Package: 0201; Voltage Rating: 6.3V; Length: 0.6mm; Max Operating Temperature: 85°C; Width: 0.012inch; Depth: 0.3mm; Material: Ceramic; Case Code (Metric): 0603; Thickness: 0.013inch; Packaging: Tape and Reel; Height: 0.3mm; Weight: 6E-06oz; Package Quantity: 1; Mount: Surface Mount; Voltage: 6.3V; Case Code (Imperial): 0201; Tolerance: 10%; Termination: SMD/SMT
D1 = CMP-0894-00001-3: Surface Mount Standard Recovery Power Rectifier, 2-Pin SMA, Pb-Free, Tape and Reel; Manufacturer: On Semiconductor; VRRM Max (V): 600; IFSM Max (A): 30; IO(rec) Max (A): 1; RoHS: TRUE; PackageDescription: 2-Pin Small Molded Package, J-Bend Lead, Body 2.605 x 4.315 mm; ComponentLink1Description: Manufacturer URL; ComponentLink2Description: Datasheet; Packing: Tape and Reel; ComponentLink2URL: http://www.onsemi.com/pub_link/Collateral/MRA4003T3-D.PDF; DatasheetVersion: Rev. 9; ComponentLink3Description: Package Specification; Mounting Technology: Surface Mount; PackageReference: SMA-2-403D-02; ComponentLink1URL: http://www.onsemi.com/; ComponentLink3URL: http://www.onsemi.com/pub_link/Collateral/403D-02.PDF; PackageVersion: Rev. G, 07/2012; Type: Standard Recovery; PartNumber: MRA4005T3G
D2 = CMP-22017-000025-1: LED YELLOW CLEAR SMD; Dominant Wavelength: 597nm; Power Rating: 75mW; Number of LEDs: 1; Lens Style: Diffused; Forward Current: 30mA; Test Current: 20mA; Forward Voltage: 2.4V; Wavelength: 588nm; Viewing Angle: 130°; Lens Color: Colorless; Reverse Voltage: 5V; Luminous Intensity: 180mcd; Case Code (Imperial): 0603; Width: 0.8mm; Power Dissipation: 75mW; Length: 1.6mm; Illumination Color: Yellow; Number of Pins: 2; Case Code (Metric): 1608; Mount: Surface Mount; Number of Elements: 1; Height: 0.55mm; Lens Transparency: Clear; Depth: 0.8mm; Min Operating Temperature: -55°C; Case/Package: 0603; Radiation Hardening: No; Max Operating Temperature: 85°C; Package Quantity: 1; Packaging: Tape and Reel; Lead Free: Lead Free; Color: Yellow
FB1 = CMP-0686-00187-4: Chip Ferrite Bead, 0402, 600Ω @ 100MHz, 0.52Ω, 25%, 300mA; DC Resistance-Max: 600mR; Number of Lines: 1; DC Resistance (DCR): 520mR; Shielding: Unshielded; Impedance: 600R; Material: Steel; Frequency: 100MHz; Lead Free: Lead Free; Max DC Current: 300mA; Test Frequency: 100MHz; Depth: 0.55mm; Length: 1mm; Case Code (Imperial): 0402; Packaging: Tape and Reel; Height: 0.5mm; Max Operating Temperature: 125°C; Military Standard: Not; REACH SVHC: No SVHC; Case Code (Metric): 1005; Series: BLM15AG_SN; Core Material: Ferrite; Termination: SMD/SMT; DC Current: 300mA; Package Quantity: 10000; Width: 0.5mm; RoHS Compliant: Yes; Min Operating Temperature: -55°C; Current Rating: 300mA; Case/Package: 0402; Number of Pins: 2; Radiation Hardening: No; Tolerance: 25%; Number of Circuits: 1; Max Current Rating: 300mA
J10 = CMP-02766-001428-1: as J9 on sheet ADC; Radiation Hardening: No; Orientation: Straight; Contact Plating: Gold; Max Operating Temperature: 125°C; Mount: Through Hole; Package Quantity: 1; Number of Rows: 1; Housing Material: Polyester; RoHS Compliant: Yes; Length: 5.08mm; Max Voltage Rating (AC): 550V; Pitch: 2.54mm; Packaging: Bulk; Depth: 2.54mm; Termination: Solder; Min Operating Temperature: -55°C; Housing Color: Black; Lead Free: Lead Free; Color: Black; Number of Positions: 2; Width: 2.54mm; Max Current Rating: 7.6A; REACH SVHC: No SVHC; Contact Material: Bronze; Contact Mating Length: 0.23inch; Series: TSW; Contact Type: Male Pin
R12 = CMP-2100-03670-1: as R1 on sheet 3.3V; Number of Pins: 2; REACH SVHC: NoSVHC; Datasheet Version: Rev. 5, 10/2016; Max Operating Temperature: 155degC; Manufacturer URL: http://www.yageo.com/; Case Code (Imperial): 0805; Package Description: 2-Pin Surface Mounted Device, Body 2 x 1.25 mm; Case Code (Metric): 2012; Length: 2mm; RoHSCompliant: true; Max Power Dissipation: 125mW; Depth: 1.25mm; Packaging: TapeandReel; Height: 0.5mm; Package Reference: 0805; Package Quantity: 1; Tolerance: 1%; Termination: SMD/SMT; Min Operating Temperature: -55degC; Lead Free: LeadFree; Width: 1.25mm; Voltage Rating (DC): 150V; Datasheet URL: http://www.yageo.com/NewPortal/yageodocoutput?fileName=/pdf/R-Chip/PYu-RC_Group_51_RoHS_L_5.pdf; Composition: ThickFilm; Number of Terminations: 2; Case/Package: 0805
R13 = CMP-2000-00025-1: Part Number: ERA3AEB301V; Manufacturer: Panasonic
U5 U6 = CMP-0136-00458-1: 500 mA, Low Voltage, Low Quiescent Current LDO Regulator, 3-Pin SOT-223, Extended Temperature; PackageReference: SOT-223-DB3; PackageDescription: 3-Lead Plastic Small Outline Transistor (DB) [SOT-223]; PackageVersion: revBB, Aug-2009; DatasheetVersion: revB, Feb-2008
U7 = CMP-0136-01141-1: 150 mA, 16 V, High Performance LDO, -40 to 125 degC, 3-pin SOT-23A (CB3), Tape and Reel; Manufacturer: Microchip; ComponentLink1Description: Manufacturer URL; PackageVersion: C04-130B; ComponentLink1URL: http://www.microchip.com; ComponentLink3Description: Package Specification; ComponentLink4URL: http://www.microchip.com/MCP1754S; ComponentLink2URL: http://ww1.microchip.com/downloads/en/DeviceDoc/22276A.pdf; ComponentLink2Description: Datasheet; PackageDescription: 3-Lead Plastic Small Outline Transistor, 2.9 x 1.5 mm Body, 0.95 mm Pitch; ComponentLink3URL: http://www.microchip.com/stellent/groups/techpub_sg/documents/packagingspec/en012702.pdf; ComponentLink4Description: Product URL; PackageReference: SOT-23A-CB3; Mounting Technology: Surface Mount; PartNumber: MCP1754ST-3302E/CB; DatasheetVersion: Rev. A
U8 = CMP-0136-01167-1: 150 mA, 16 V, High Performance LDO, -40 to 125 degC, 3-pin SOT-89 (MB3), Tape and Reel; Manufacturer: Microchip; PartNumber: MCP1754ST-5002E/MB; PackageDescription: 3-Lead Plastic Small Outline Transistor Header, 4.5 x 2.45 mm Body, 1.5 mm Pitch; Mounting Technology: Surface Mount; ComponentLink3Description: Package Specification; PackageVersion: C04-029B; ComponentLink4Description: Product URL; ComponentLink2Description: Datasheet; ComponentLink3URL: http://www.microchip.com/stellent/groups/techpub_sg/documents/packagingspec/en012702.pdf; PackageReference: SOT-89-MB3; ComponentLink2URL: http://ww1.microchip.com/downloads/en/DeviceDoc/22276A.pdf; ComponentLink1Description: Manufacturer URL; ComponentLink1URL: http://www.microchip.com; ComponentLink4URL: http://www.microchip.com/MCP1754S; DatasheetVersion: Rev. A
U9 = CMP-0062-01637-4: 800mA Low-Dropout Linear Regulator, 4-pin SOT-223; PartNumber: LM1117MPX-5.0; Manufacturer: Texas Instruments; High-Reliability: Y; PowerWise: N; PackageTopMarking: XYTT*N06A; CompType: LDO IC; PackageDescription: Molded SOT-223, 6.50 x 3.56 x 1.6mm Body, 4 Lead, 2.3mm Pitch; PackageReference: DCY0004A; ComponentLink1URL: http://www.ti.com/general/docs/lit/getliterature.tsp?genericPartNumber=LM1117-N&fileType=pdf; Code_JEDEC: TO-261-AA; ComponentLink1Description: Datasheet URL; Code_IPC: SOT223-4; RoHS: N; PinCount: 4

## Sheet ETH.SchDoc
size A; SheetNumber: 5; SheetTotal: 7
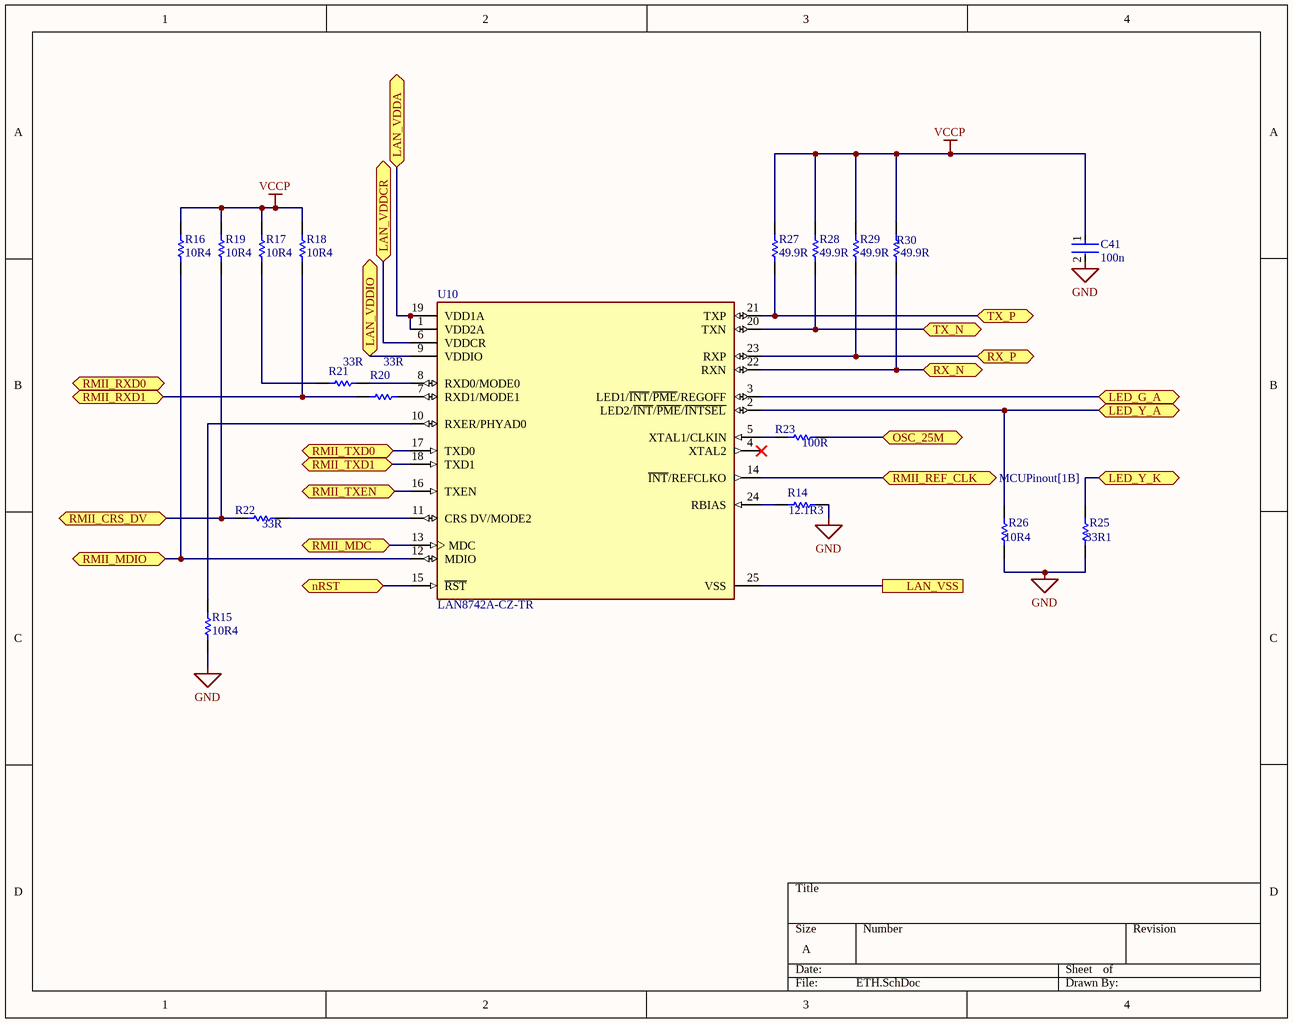
[diagram p4: ETH.SchDoc]

### Parts
C41  100n  [FP-GRM033-0_03-MFG]
R14  12.1R3  [RESC1608X55X30LL20T20]
R15  10R4  [RESC1608X55X30LL20T20]
R16  10R4  [RESC1608X55X30LL20T20]
R17  10R4  [RESC1608X55X30LL20T20]
R18  10R4  [RESC1608X55X30LL20T20]
R19  10R4  [RESC1608X55X30LL20T20]
R20  33R  [RESC1608X55X30LL20T20]
R21  33R  [RESC1608X55X30LL20T20]
R22  33R  [RESC1608X55X30LL20T20]
R23  100R  [RESC1608X55X30LL20T20]
R25  33R1  [RESC1608X55X30LL20T20]
R26  10R4  [RESC1608X55X30LL20T20]
R27  49.9R  [RESC1608X55X30LL20T20]
R28  49.9R  [RESC1608X55X30LL20T20]
R29  49.9R  [RESC1608X55X30LL20T20]
R30  49.9R  [RESC1608X55X30LL20T20]
U10  LAN8742A-CZ-TR  [FP-C04-143B-S4QFN-MFG]

### Ports
LAN_VDDA (bidir, see 3.3V[3C]), LAN_VDDCR (bidir, see 3.3V[4C]), LAN_VDDIO (bidir, see 3.3V[3C]), LAN_VSS (see 3.3V[4C]), LED_G_A (bidir, see RJ45[3C]), LED_Y_A (bidir, see RJ45[3C]), LED_Y_K (bidir, see RJ45[3C]), nRST (bidir, see MCUPinout[1B], Random[2A], Random[2C]), OSC_25M (bidir, see ADC[2C]), RMII_CRS_DV (bidir, see MCUPinout[1C]), RMII_MDC (bidir, see MCUPinout[1B]), RMII_MDIO (bidir, see MCUPinout[1B]), RMII_REF_CLK (bidir, see MCUPinout[1B]), RMII_RXD0 (bidir, see MCUPinout[1C]), RMII_RXD1 (bidir, see MCUPinout[1C]), RMII_TXD0 (bidir, see MCUPinout[4C]), RMII_TXD1 (bidir, see MCUPinout[4A]), RMII_TXEN (bidir, see MCUPinout[4C]), RX_N (bidir, see RJ45[1C]), RX_P (bidir, see RJ45[1C]), TX_N (bidir, see RJ45[1B]), TX_P (bidir, see RJ45[1B])

### Nets
GND: C41.2 R14.2 R15.1 R25.1 R26.1 U10.25(VSS) ; port LAN_VSS
VCCP: C41.1 R16.2 R17.2 R18.2 R19.2 R27.2 R28.2 R29.2 R30.2 U10.1(VDD2A) U10.9(VDDIO) U10.19(VDD1A) ; port LAN_VDDA, port LAN_VDDIO
RX_N: R30.1 U10.22(RXN) ; port RX_N
RX_P: R29.1 U10.23(RXP) ; port RX_P
TX_N: R28.1 U10.20(TXN) ; port TX_N
TX_P: R27.1 U10.21(TXP) ; port TX_P
NetC43_1: U10.6(VDDCR) ; port LAN_VDDCR
NetD4_6: U10.15(~{RST}) ; port nRST
NetJ11_9: R26.2 U10.2(LED2/~{INT}/~{PME}/~{INTSEL}) ; port LED_Y_A
NetJ11_10: R25.2 ; port LED_Y_K
NetJ11_11: U10.3(LED1/~{INT}/~{PME}/REGOFF) ; port LED_G_A
NetR14_1: R14.1 U10.24(RBIAS)
NetR15_2: R15.2 U10.10(RXER/PHYAD0)
NetR16_1: R16.1 U10.12(MDIO) ; port RMII_MDIO
NetR17_1: R17.1 R21.1
NetR18_1: R18.1 R20.1 ; port RMII_RXD1
NetR19_1: R19.1 R22.1 ; port RMII_CRS_DV
NetR20_2: R20.2 U10.7(RXD1/MODE1)
NetR21_2: R21.2 U10.8(RXD0/MODE0)
NetR22_2: R22.2 U10.11(CRS_DV/MODE2)
NetR23_1: R23.1 U10.5(XTAL1/CLKIN)
NetR23_2: R23.2 ; port OSC_25M
NetU1_27: U10.13(MDC) ; port RMII_MDC
NetU1_35: U10.14(~{INT}/REFCLKO) ; port RMII_REF_CLK
NetU1_74: U10.18(TXD1) ; port RMII_TXD1
NetU1_126: U10.16(TXEN) ; port RMII_TXEN
NetU1_128: U10.17(TXD0) ; port RMII_TXD0

Not connected (* = marked no-connect by the designer): U10 4(XTAL2)*

### Library data of the parts
C41 = CMP-06035-000062-2: as C1 on sheet 3.3V; Min Operating Temperature: -55°C; Lead Free: Lead Free; Radiation Hardening: No; Dielectric: X5R; Voltage Rating (DC): 6.3V; REACH SVHC: No SVHC; Case/Package: 0201; Voltage Rating: 6.3V; Length: 0.6mm; Max Operating Temperature: 85°C; Width: 0.012inch; Depth: 0.3mm; Material: Ceramic; Case Code (Metric): 0603; Thickness: 0.013inch; Packaging: Tape and Reel; Height: 0.3mm; Weight: 6E-06oz; Package Quantity: 1; Mount: Surface Mount; Voltage: 6.3V; Case Code (Imperial): 0201; Tolerance: 10%; Termination: SMD/SMT
R14-R23 R25-R30 = CMP-2000-00025-1: as R13 on sheet BAT
U10 = CMP-06281-000006-2: IC TRANSCEIVER 1/1 24SQFN; Manufacturer: Microchip; Nominal Supply Current: 6.5-59mA; Max Supply Voltage: 3.6V; Number Of Channels: 1; Data Rate: 100Mbits/s; Interface: Ethernet,Other; Min Supply Voltage: 1.14V; Standoff Height: 0mm; Simplex Duplex: Full-Duplex; Height: 1mm; Ambient Temperature Range High: +70°C; Category: IC; Mouser Description: Small Footprint RMII 10/100 Ethernet Transceiver with flexPWR Technology; Manufacturer Part Number: LAN8742A-CZ-TR; Digikey Description: IC TRANSCEIVER 1/1 24SQFN; Octopart: https://octopart.com/lan8742a-cz-tr-microchip-29030587; Temperature: 0°C to +70°C; Ambient Temperature Range Low: 0°C; Temperature Range Low: 0°C; ComponentLink2Description: Datasheet; Automotive: No; RoHS: TRUE; Device Class L3: Ethernet Interface ICs; Device Class L1: Integrated Circuits (ICs); Device Class L2: Interface ICs; Lead Free: Yes; Ipc Land Pattern Name: QFN50P400X400X90-24; ComponentLink2URL: http://ww1.microchip.com/downloads/en/DeviceDoc/DS_LAN8742_00001989A.pdf; Temperature Range High: +70°C; Package: C04-143B-S4QFN

## Sheet RJ45.SchDoc
size A; SheetNumber: 6; SheetTotal: 7
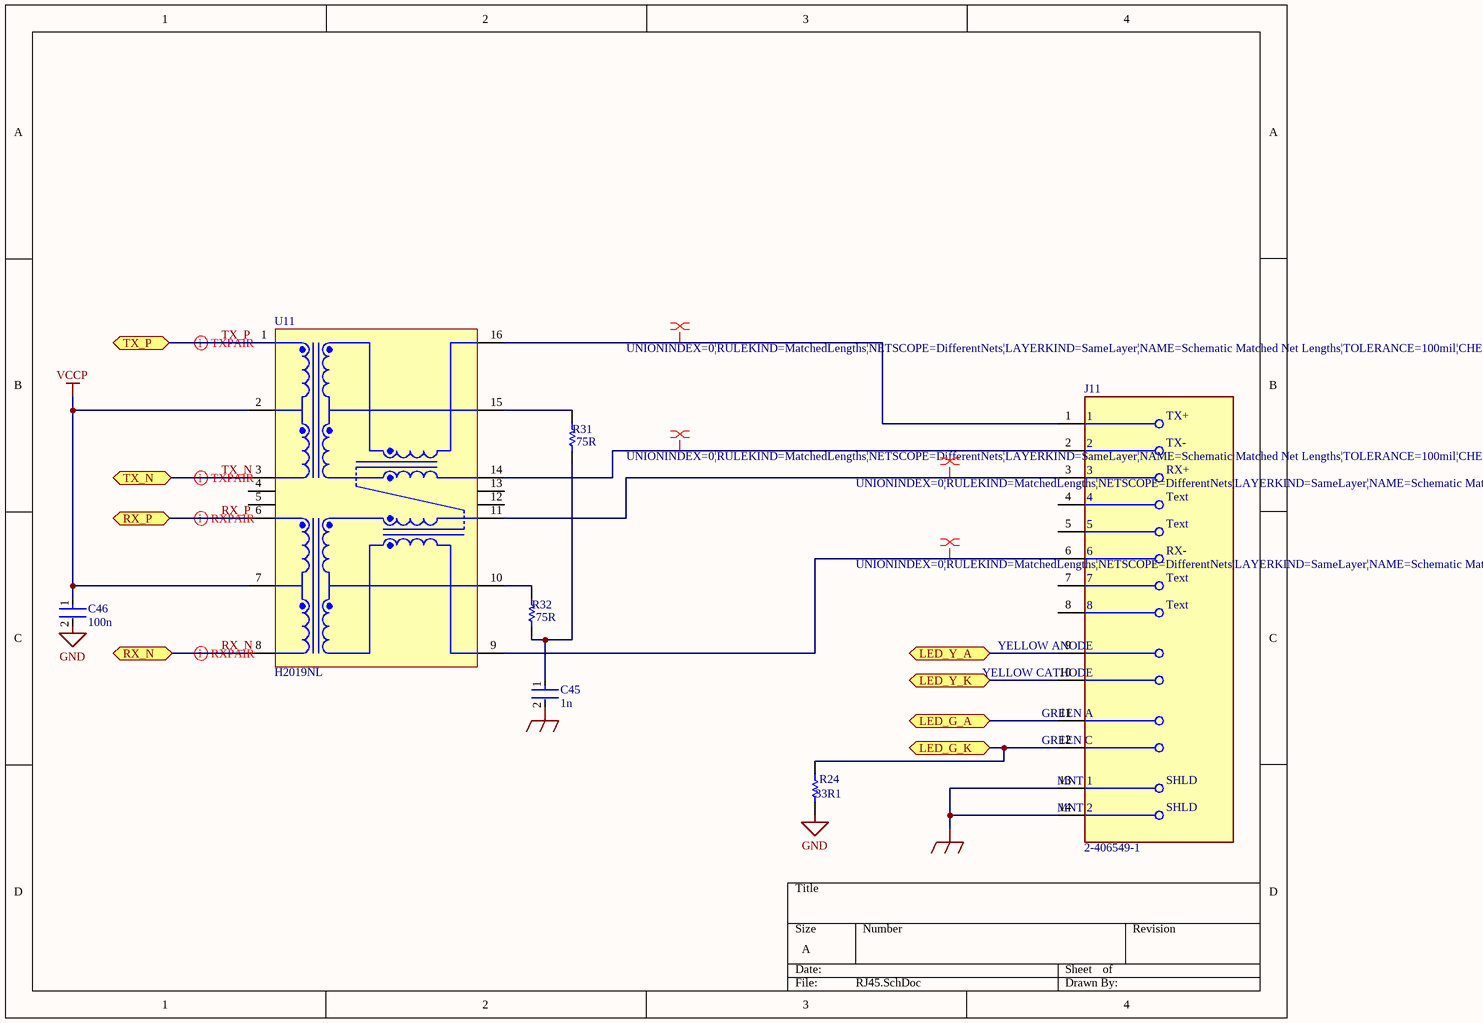
[diagram p5: RJ45.SchDoc]

### Parts
C45  1n  [FP-GRM033-0_03-MFG]
C46  100n  [FP-GRM033-0_03-MFG]
J11  2-406549-1  [FP-2-406549-1-MFG]
R24  33R1  [RESC1608X55X30LL20T20]
R31  75R  [RESC1608X55X30LL20T20]
R32  75R  [RESC1608X55X30LL20T20]
U11  H2019NL  [PULS-H2019FNL_V]

### Ports
LED_G_A (bidir, see ETH[4B]), LED_G_K (bidir), LED_Y_A (bidir, see ETH[4B]), LED_Y_K (bidir, see ETH[4B]), RX_N (bidir, see ETH[3B]), RX_P (bidir, see ETH[4B]), TX_N (bidir, see ETH[3B]), TX_P (bidir, see ETH[4B])

### Nets
GND: C45.2 C46.2 J11.13(MNT_1) J11.14(MNT_2) R24.1
VCCP: C46.1 U11.2(TCT) U11.7(RCT)
RX_N: U11.8(RD-) ; port RX_N
RX_P: U11.6(RD+) ; port RX_P
TX_N: U11.3(TD-) ; port TX_N
TX_P: U11.1(TD+) ; port TX_P
NetC45_1: C45.1 R31.1 R32.1
NetJ11_1: J11.1 U11.16(TX+)
NetJ11_2: J11.2 U11.14(TX-)
NetJ11_3: J11.3 U11.11(RX+)
NetJ11_6: J11.6 U11.9(RX-)
NetJ11_9: J11.9(YELLOW_ANODE) ; port LED_Y_A
NetJ11_10: J11.10(YELLOW_CATHODE) ; port LED_Y_K
NetJ11_11: J11.11(GREEN_A) ; port LED_G_A
NetJ11_12: J11.12(GREEN_C) R24.2 ; port LED_G_K
NetR31_2: R31.2 U11.15(TXCT)
NetR32_2: R32.2 U11.10(RXCT)

Not connected (* = marked no-connect by the designer): J11 4 5 7 8; U11 4(NC) 5(NC) 12(NC) 13(NC)

### Layout directives
differential pair: RX_N, RX_P, TX_N, TX_P
rule Matched Net Lengths [Tolerance = 100mil]; rule Differential Pairs Routing [Pref Gap = 10mil    Min Gap  = 10mil    Max Gap  = 10milPref Width = 15mil    Min Width  = 15mil    Max Width  = 15mil]: NetJ11_1, NetJ11_2, NetJ11_3, NetJ11_6

### Notes on the sheet
- TX+
- TX-
- RX+
- Text
- RX-
- SHLD

### Library data of the parts
C45 C46 = CMP-06035-000062-2: as C1 on sheet 3.3V; Min Operating Temperature: -55°C; Lead Free: Lead Free; Radiation Hardening: No; Dielectric: X5R; Voltage Rating (DC): 6.3V; REACH SVHC: No SVHC; Case/Package: 0201; Voltage Rating: 6.3V; Length: 0.6mm; Max Operating Temperature: 85°C; Width: 0.012inch; Depth: 0.3mm; Material: Ceramic; Case Code (Metric): 0603; Thickness: 0.013inch; Packaging: Tape and Reel; Height: 0.3mm; Weight: 6E-06oz; Package Quantity: 1; Mount: Surface Mount; Voltage: 6.3V; Case Code (Imperial): 0201; Tolerance: 10%; Termination: SMD/SMT
J11 = CMP-2000-05541-2: CONN MOD JACK 8P8C R/A SHIELDED; Max Voltage Rating (AC): 150V; Number of Contacts: 8; PCB Mounting Orientation: Right Angle; Direction: Up; Pitch: 2.03mm; Number of Ports: 1; Gender: Female; Tail Length: 2.54mm; Current Rating: 1.5A; Keyed: No; Approvals: UL; PCB Thickness: 1.57mm; Element Configuration: Single; Connector Type: Jack; Color: Yellow; Max Operating Temperature: 85°C; Weight: 0.144729oz; Series: -; Orientation: Right Angle; Width: 17.27mm; Package Quantity: 63; Mount: Panel; Contact Plating: Gold; Length: 17.86mm; Depth: 15.75mm; Flammability Rating: UL94 V-0; Shielding: Shielded; Housing Material: Thermoplastic; Number of Positions Loaded: 8; Contact Material: Bronze; Voltage Rating: 150V; Packaging: Tray; Number of Positions: 8; Termination: Solder; Number of Rows: 1; Radiation Hardening: No; Min Operating Temperature: -40°C; RoHS Compliant: Yes; Housing Color: Black
R24 R31 R32 = CMP-2000-00025-1: as R13 on sheet BAT
U11 = CMP-2000-06384-1: Telecom Transformer, 100BASE-TX, 0 to 70 degC, 16-Pin SMD, RoHS; Manufacturer: Pulse Electronics; Other Names: 553-2199; Other Related Documents: PackagesFNLvs.NL; Mounting Technology: SurfaceMount; Manufacturer URL: http://www.pulseelectronics.com/; Package Description: 16-Pin Surface Mount Device, Body 12.7 x 9.09 mm, Pitch 1.27 mm; Package Reference: H2019FNL; Standard Package: 40; Datasheet Version: Rev. A, 06/2014; Category: Transformers; Family: PulseTransformers; Datasheet URL: http://productfinder.pulseeng.com/products/datasheets/H2019FNL.pdf

## Sheet Random.SchDoc
size A; SheetNumber: 7; SheetTotal: 7
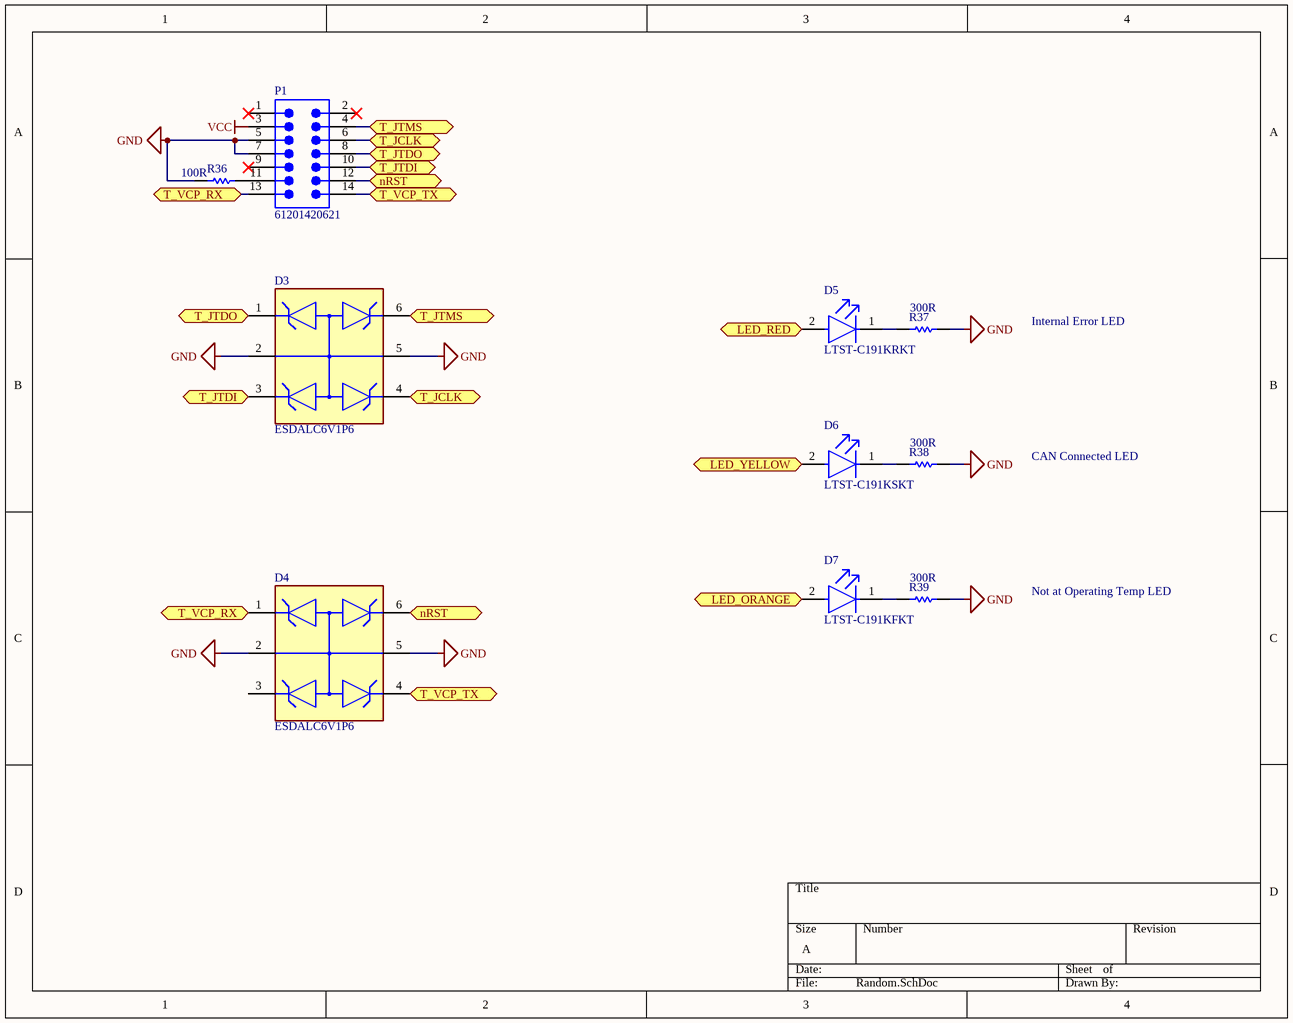
[diagram p6: Random.SchDoc]

### Parts
D3  ESDALC6V1P6  [FP-SOT-666IP-MFG]
D4  ESDALC6V1P6  [FP-SOT-666IP-MFG]
D5  LTST-C191KRKT  [FP-LTST-C191KSKT-MFG]
D6  LTST-C191KSKT  [FP-LTST-C191KSKT-MFG]
D7  LTST-C191KFKT  [FP-LTST-C191KSKT-MFG]
P1  61201420621  [61201420621]
R36  100R  [RESC1608X55X30LL20T20]
R37  300R  [RESC1608X55X30LL20T20]
R38  300R  [RESC1608X55X30LL20T20]
R39  300R  [RESC1608X55X30LL20T20]

### Ports
LED_ORANGE (bidir, see MCUPinout[3C]), LED_RED (bidir, see MCUPinout[1C]), LED_YELLOW (bidir, see MCUPinout[1A], MCUPinout[4C]), nRST (bidir, see ETH[1C], MCUPinout[1B], Random[2A]), nRST (bidir, see ETH[1C], MCUPinout[1B], Random[2C]), T_JCLK (bidir, see MCUPinout[4B], Random[2A]), T_JCLK (bidir, see MCUPinout[4B], Random[2B]), T_JTDI (bidir, see MCUPinout[5C], Random[1B]), T_JTDI (bidir, see MCUPinout[5C], Random[2A]), T_JTDO (bidir, see MCUPinout[4C], Random[1B]), T_JTDO (bidir, see MCUPinout[4C], Random[2A]), T_JTMS (bidir, see MCUPinout[4B], Random[2A]), T_JTMS (bidir, see MCUPinout[4B], Random[2B]), T_VCP_RX (bidir, see MCUPinout[4A], Random[1A]), T_VCP_RX (bidir, see MCUPinout[4A], Random[1C]), T_VCP_TX (bidir, see MCUPinout[4A], Random[2A]), T_VCP_TX (bidir, see MCUPinout[4A], Random[2C])

### Nets
GND: D3.2 D3.5 D4.2 D4.5 P1.5 P1.7 R36.2 R37.2 R38.2 R39.2
VCC: P1.3
NetD3_1: D3.1 P1.8 ; port T_JTDO
NetD3_3: D3.3 P1.10 ; port T_JTDI
NetD3_4: D3.4 P1.6 ; port T_JCLK
NetD3_6: D3.6 P1.4 ; port T_JTMS
NetD4_1: D4.1 P1.13 ; port T_VCP_RX
NetD4_4: D4.4 P1.14 ; port T_VCP_TX
NetD4_6: D4.6 P1.12 ; port nRST
NetD5_1: D5.1(C) R37.1
NetD5_2: D5.2(A) ; port LED_RED
NetD6_1: D6.1(C) R38.1
NetD6_2: D6.2(A) ; port LED_YELLOW
NetD7_1: D7.1(C) R39.1
NetD7_2: D7.2(A) ; port LED_ORANGE
NetP1_11: P1.11 R36.1

Not connected (* = marked no-connect by the designer): D4 3; P1 1* 2* 9*

### Notes on the sheet
- Internal Error LED
- CAN Connected LED
- Not at Operating Temp LED

### Library data of the parts
D3 D4 = CMP-12225-000016-1: TVS DIODE 3V SOT666IP; Manufacturer: STMicroelectronics; Peak Pulse Power: 30W; Capacitance: 7.5pF; Value: 7.5pF; Number Of Channels: 4; Max Junction Temp: +150°C; Breakdown Voltage: 6.1V; Direction: Unidirectional; Device Class L1: Circuit Protection; Reverse Standoff Voltage: 3V; Package: SOT-666IP; Device Class L3: unset; Temperature Range Low: -40°C; ComponentLink2Description: Datasheet; Height: 0.62mm; ComponentLink2URL: https://www.st.com/resource/en/datasheet/esdalc6v1px.pdf; Category: Diode; RoHS: TRUE; Device Class L2: TVS Diodes; Mouser Description: ESDALC Series 4 Channel 6.1V Uni-Directional Transil? ESD Protection - SOT-666IP; Lead Free: Yes; Manufacturer Part Number: ESDALC6V1P6; Temperature Range High: +150°C; Temperature: -40°C to +150°C; Digikey Description: TVS DIODE 3V SOT666IP; Automotive: No; Octopart: https://octopart.com/esdalc6v1p6-stmicroelectronics-347727
D5-D7 = CMP-22017-000025-1: as D2 on sheet BAT; Case Code (Imperial): 0603; Width: 0.8mm; Power Dissipation: 75mW; Length: 1.6mm; Illumination Color: Yellow; Number of Pins: 2; Case Code (Metric): 1608; Mount: Surface Mount; Number of Elements: 1; Height: 0.55mm; Lens Transparency: Clear; Depth: 0.8mm; Min Operating Temperature: -55°C; Case/Package: 0603; Radiation Hardening: No; Max Operating Temperature: 85°C; Package Quantity: 1; Packaging: Tape and Reel; Lead Free: Lead Free; Color: Yellow
P1 = CMP-1502-00053-2: NexarPartId: 24514104; Number of Contacts: 14; Contact Resistance: 20mΩ; Connector Type: Male Pin; Row Spacing: 2.54mm; Gender: Male; Operating Supply Voltage: 250V; RoHS: Compliant; Contact Mating Length: 5.08mm; Contact Plating: Gold; Number of Positions: 14; Color: Black; Orientation: Vertical; Lead Pitch: 2.54mm; Contact Material: Copper; REACH SVHC: Unknown; Number of Pins: 14; Pitch: 2.54mm; Mount: Surface Mount; Number of Rows: 2; Termination: Solder
R36-R39 = CMP-2000-00025-1: as R13 on sheet BAT

## Nets that join several sheets
GND: 3.3V (27 pins), MCUPinout (10 pins), ADC (11 pins), BAT (27 pins), ETH (6 pins), RJ45 (5 pins), Random (10 pins)
VCC: 3.3V (8 pins), MCUPinout (9 pins), ADC (C47.1 R33.1 Y1.4), BAT (C22.2 C23.1 D2.2 U5.3), Random (P1.3)
VCC5V: ADC (U4.3), BAT (C33.2 C34.1 U8.3)
VCCA: 3.3V (C7.1 C8.1 R1.1), MCUPinout (U1.33), BAT (C29.2 C30.1 U7.2)
VCCP: 3.3V (8 pins), ADC (5 pins), BAT (C26.2 C27.1 U6.3), ETH (12 pins), RJ45 (C46.1 U11.2 U11.7)
NetC11_1: 3.3V (C11.1), MCUPinout (U1.39)
NetC12_1: 3.3V (C12.1), MCUPinout (U1.108)
NetC13_1: 3.3V (C13.1), MCUPinout (U1.52)
NetC14_1: 3.3V (C14.1 C15.1 R1.2), ADC (U2.1)
NetC16_1: 3.3V (C16.1), ADC (U2.4)
NetC17_1: 3.3V (C17.1 C18.1 R2.2), ADC (U2.20)
NetC43_1: 3.3V (C43.1 C44.1), ETH (U10.6)
NetD3_1: MCUPinout (U1.133), Random (D3.1 P1.8)
NetD3_4: MCUPinout (U1.109), Random (D3.4 P1.6)
NetD3_6: MCUPinout (U1.105), Random (D3.6 P1.4)
NetD4_1: MCUPinout (U1.77), Random (D4.1 P1.13)
NetD4_4: MCUPinout (U1.78), Random (D4.4 P1.14)
NetD4_6: MCUPinout (U1.25), ETH (U10.15), Random (D4.6 P1.12)
NetD5_2: MCUPinout (U1.46), Random (D5.2)
NetD6_2: MCUPinout (U1.10 U1.142), Random (D6.2)
NetD7_2: MCUPinout (U1.47), Random (D7.2)
NetJ11_9: ETH (R26.2 U10.2), RJ45 (J11.9)
NetJ11_10: ETH (R25.2), RJ45 (J11.10)
NetJ11_11: ETH (U10.3), RJ45 (J11.11)
NetR3_2: MCUPinout (U1.19), ADC (R3.2)
NetR4_2: MCUPinout (U1.136), ADC (R4.2)
NetR5_2: MCUPinout (U1.41), ADC (R5.2)
NetR6_2: MCUPinout (U1.123), ADC (R6.2)
NetR7_2: MCUPinout (U1.42), ADC (R7.2)
NetR8_2: MCUPinout (U1.37), ADC (R8.2)
NetR10_2: MCUPinout (U1.139), ADC (R10.2 U3.1)
NetR11_2: MCUPinout (U1.137), ADC (R11.2 U3.0)
NetR16_1: MCUPinout (U1.36), ETH (R16.1 U10.12)
NetR18_1: MCUPinout (U1.45), ETH (R18.1 R20.1)
NetR19_1: MCUPinout (U1.43), ETH (R19.1 R22.1)
NetR23_2: ADC (R35.2), ETH (R23.2)
NetU1_27: MCUPinout (U1.27), ETH (U10.13)
NetU1_35: MCUPinout (U1.35), ETH (U10.14)
NetU1_74: MCUPinout (U1.74), ETH (U10.18)
NetU1_103: MCUPinout (U1.103), ADC (U4.4)
NetU1_104: MCUPinout (U1.104), ADC (U4.1)
NetU1_126: MCUPinout (U1.126), ETH (U10.16)
NetU1_128: MCUPinout (U1.128), ETH (U10.17)
RX_N: ETH (R30.1 U10.22), RJ45 (U11.8)
RX_P: ETH (R29.1 U10.23), RJ45 (U11.6)
TX_N: ETH (R28.1 U10.20), RJ45 (U11.3)
TX_P: ETH (R27.1 U10.21), RJ45 (U11.1)